# EAGLE design untitled (EAGLE 7.4.0)
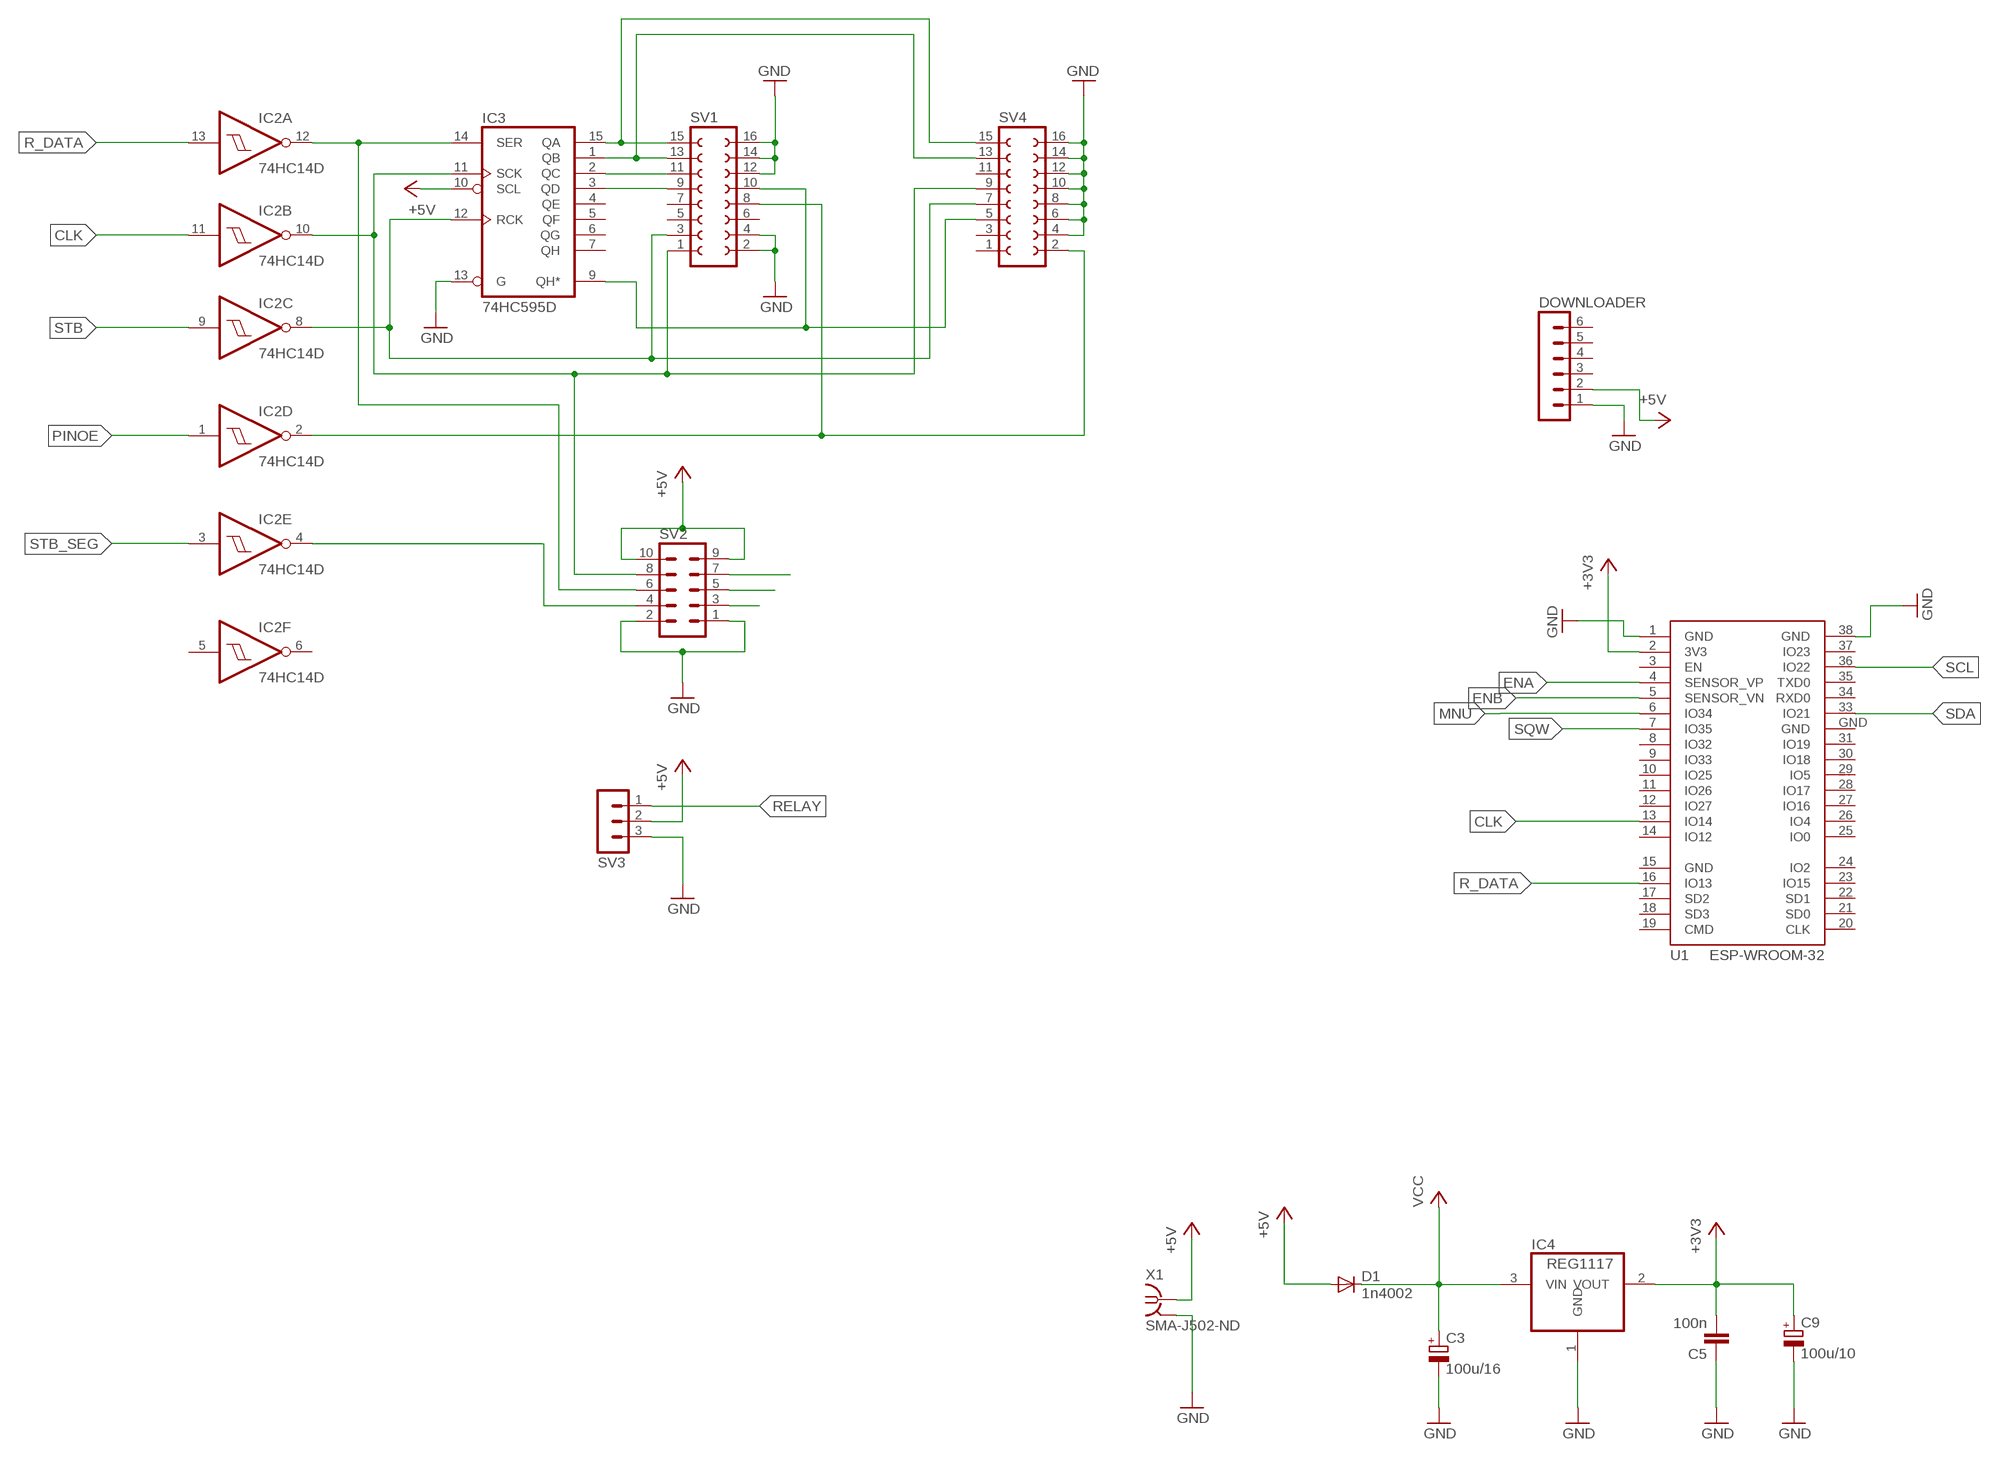
[diagram p0: schematic, sheet 1, part 1 of 2]
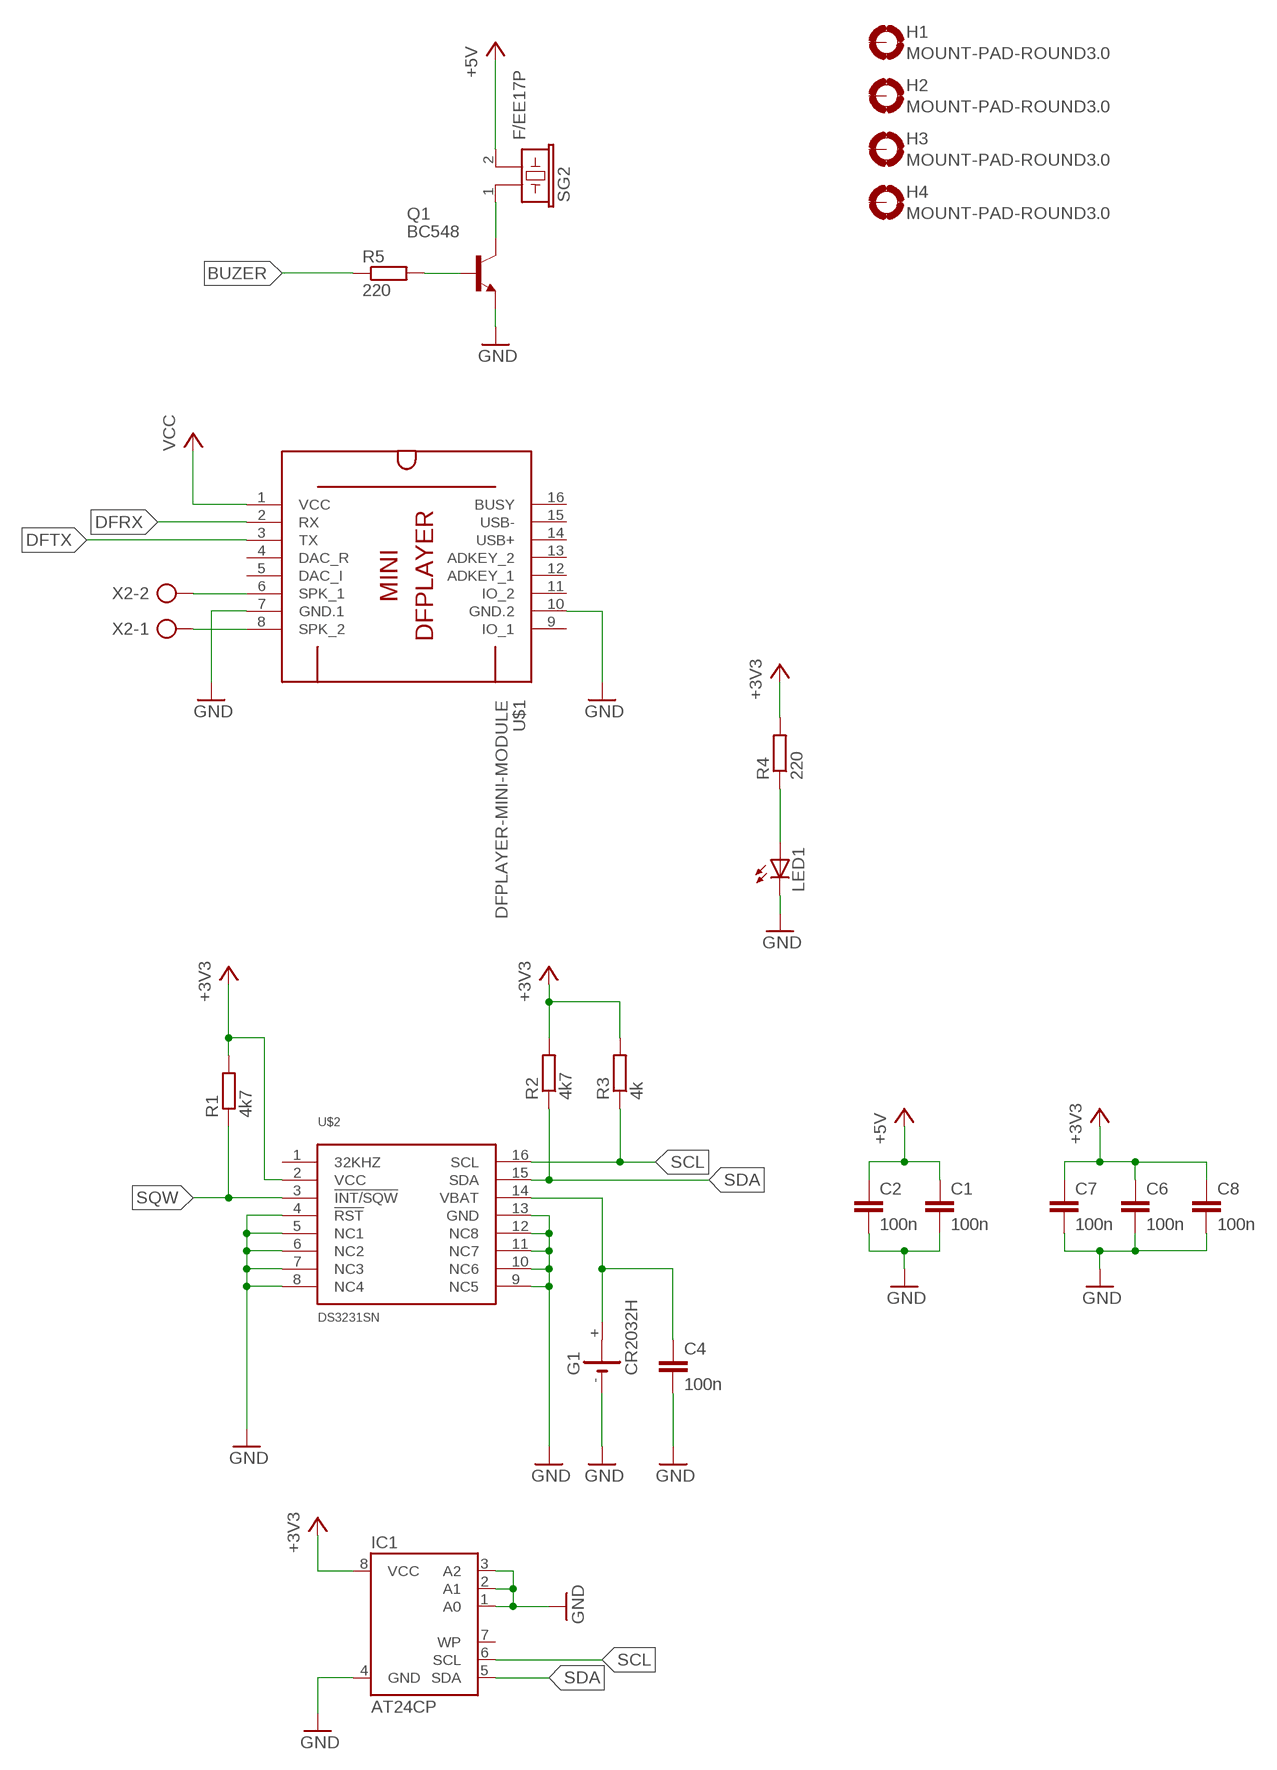
[diagram p1: schematic, sheet 1, part 2 of 2]

## Parts
C1  100n  C-EU025-025X050  [C025-025X050]
C2  100n  C-EU025-025X050  [C025-025X050]
C3  100u/16  CPOL-EUE2.5-6  [E2,5-6]
C4  100n  C-EU025-025X050  [C025-025X050]
C5  100n  C-EU025-025X050  [C025-025X050]
C6  100n  C-EU025-025X050  [C025-025X050]
C7  100n  C-EU025-025X050  [C025-025X050]
C8  100n  C-EU025-025X050  [C025-025X050]
C9  100u/10  CPOL-EUE2.5-5  [E2,5-5]
D1  1n4002  1N4148DO35-10  [DO35-10]
DOWNLOADER  MA06-1  [MA06-1]
G1  CR2032H  [CR2032H]
H1  MOUNT-PAD-ROUND3.0  [3,0-PAD]
H2  MOUNT-PAD-ROUND3.0  [3,0-PAD]
H3  MOUNT-PAD-ROUND3.0  [3,0-PAD]
H4  MOUNT-PAD-ROUND3.0  [3,0-PAD]
IC1  AT24CP  [DIL08]
IC2  74HC14D  [SO14]
IC3  74HC595D  [SO16]
IC4  REG1117  [SOT223]
LED1  LED3MM  [LED3MM]
Q1  BC548  [TO92-EBC]
R1  4k7  R-EU_0207/7  [0207/7]
R2  4k7  R-EU_0207/7  [0207/7]
R3  4k  R-EU_0207/7  [0207/7]
R4  220  R-EU_0207/7  [0207/7]
R5  220  R-EU_0207/7  [0207/7]
SG2  F/EE17P  [F/EE17P]
SV1  FE08-2  [FE08-2]
SV2  MA05-2  [MA05-2]
SV3  MA03-1  [MA03-1]
SV4  FE08-2  [FE08-2]
U1  ESP-WROOM-32  [ESP-WROOM-32]
U$1  DFPLAYER-MINI-MODULE  [DFPLAYER-MINI-MODULE]
U$2  DS3231SN  [SO16W]
X1  SMA-J502-ND  [J502-ND]
X2  AK500/2-H  [AK500/2-H]

## Nets
+3V3: C5.2 C6.1 C7.1 C8.1 C9.+ IC1.8(VCC) IC4.2(VOUT) R1.2 R2.2 R3.2 R4.2 U1.2(3V3) U$2.2(VCC)
+5V: C1.1 C2.1 D1.A DOWNLOADER.2 IC3.10(SCL) SG2.2 SV2.9 SV2.10 SV3.2 X1.3 X1.4
BUZER: R5.1
CLK: IC2.11(B:I) U1.13(IO14)
DFRX: U$1.2(RX)
DFTX: U$1.3(TX)
ENA: U1.4(SENSOR_VP)
ENB: U1.5(SENSOR_VN)
GND: C1.2 C2.2 C3.- C4.2 C5.1 C6.2 C7.2 C8.2 C9.- DOWNLOADER.1 G1.- IC1.1(A0) IC1.2(A1) IC1.3(A2) IC1.4(GND) IC3.13(G) IC4.1(GND) LED1.K(C) Q1.E SV1.2 SV1.4 SV1.12 SV1.14 SV1.16 SV2.1 SV2.2 SV3.3 SV4.4 SV4.6 SV4.8 SV4.10 SV4.12 SV4.14 SV4.16 U1.1(GND) U1.38(GND) U$1.7(GND.1) U$1.10(GND.2) U$2.4(!RST) U$2.5(NC1) U$2.6(NC2) U$2.7(NC3) U$2.8(NC4) U$2.9(NC5) U$2.10(NC6) U$2.11(NC7) U$2.12(NC8) U$2.13(GND) X1.2 X1.5
MNU: U1.6(IO34)
N$1: SV2.7
N$2: SV2.5
N$3: SV2.3
N$4: Q1.C SG2.1
N$5: C4.1 G1.+ U$2.14(VBAT)
N$6: Q1.B R5.2
N$7: LED1.A R4.1
N$8: U$1.6(SPK_1) X2.2
N$9: U$1.8(SPK_2) X2.1
N$11: IC2.12(A:O) IC3.14(SER) SV2.6
N$12: IC2.10(B:O) IC3.11(SCK) SV1.1 SV2.8 SV4.9
N$13: IC2.8(C:O) IC3.12(RCK) SV1.3 SV4.7
N$14: IC3.15(QA) SV1.15 SV4.15
N$15: IC3.1(QB) SV1.13 SV4.13
N$16: IC3.2(QC) SV1.11
N$17: IC3.3(QD) SV1.9
N$18: IC2.2(D:O) SV1.8 SV4.2
N$19: IC3.9(QH*) SV1.10 SV4.5
N$20: IC2.4(E:O) SV2.4
PINOE: IC2.1(D:I)
R_DATA: IC2.13(A:I) U1.16(IO13)
RELAY: SV3.1
SCL: IC1.6(SCL) R3.1 U1.36(IO22) U$2.16(SCL)
SDA: IC1.5(SDA) R2.1 U1.33(IO21) U$2.15(SDA)
SQW: R1.1 U1.7(IO35) U$2.3(!INT/SQW)
STB: IC2.9(C:I)
STB_SEG: IC2.3(E:I)
VCC: C3.+ D1.C IC4.3(VIN) U$1.1(VCC)
Unconnected: DOWNLOADER.3 DOWNLOADER.4 DOWNLOADER.5 DOWNLOADER.6 H1.B3,0(MOUNT) H2.B3,0(MOUNT) H3.B3,0(MOUNT) H4.B3,0(MOUNT) IC1.7(WP) IC2.5(F:I) IC2.6(F:O) IC3.4(QE) IC3.5(QF) IC3.6(QG) IC3.7(QH) SV1.5 SV1.6 SV1.7 SV4.1 SV4.3 SV4.11 U1.3(EN) U1.8(IO32) U1.9(IO33) U1.10(IO25) U1.11(IO26) U1.12(IO27) U1.14(IO12) U1.17(SD2) U1.18(SD3) U1.19(CMD) U1.20(CLK) U1.21(SD0) U1.22(SD1) U1.23(IO15) U1.24(IO2) U1.25(IO0) U1.26(IO4) U1.27(IO16) U1.28(IO17) U1.29(IO5) U1.30(IO18) U1.31(IO19) U1.34(RXD0) U1.35(TXD0) U1.37(IO23) U$1.4(DAC_R) U$1.5(DAC_I) U$1.9(IO_1) U$1.11(IO_2) U$1.12(ADKEY_1) U$1.13(ADKEY_2) U$1.14(USB+) U$1.15(USB-) U$1.16(BUSY) U$2.1(32KHZ)

## Power pins joined to a net without a drawn wire
GND: IC2.7(P:GND) IC3.8(GND) U1.15(GND) U1.GND
VCC: IC2.14(P:VCC) IC3.16(VCC)

## Library data of the parts
C1 C2 C4-C8 = pcb_control_esp:C-EU: CAPACITOR, European symbol
C3 C9 = rcl:CPOL-EU: POLARIZED CAPACITOR, European symbol
D1 = diode:1N4148: DIODE high speed (Philips)
DOWNLOADER = con-lstb:MA06-1: PIN HEADER; OC_FARNELL: unknown; OC_NEWARK: unknown
G1 = pcb_control_esp:CR2032H: LI BATTERY Varta
H1-H4 = holes:MOUNT-PAD-ROUND: MOUNTING PAD, round
IC1 = pcb_control_esp:AT24C*: 2-wire serial EEPROM; MPN: AT24C1024BW-SH-B; OC_FARNELL: 1362646; OC_NEWARK: 03P2044
IC2 = 74xx-eu:74*14: Hex schmitt trigger INVERTER
IC3 = 74xx-eu:74*595: 8-bit SHIFT REGISTER, output latch
IC4 = pcb_control_esp:REG1117: 800mA and 1A Low Dropout (LDO) Positive Regulator 1.8V, 2.5V, 2.85V, 3.3V, 5V, and Adj; MPN: REG1117; OC_FARNELL: 1097566; OC_NEWARK: 14P6981
LED1 = pcb_control_esp:LED: LED OSRAM: - CHIPLED LG R971, LG N971, LY N971, LG Q971, LY Q971, LO R971, LY R971 LH N974, LH R974 LS Q976, LO Q976, LY Q976 LO Q996 - Hyper CHIPLED LW Q18S LB Q993, LB Q99A, LB R99A - SideLED LS A670, LO A670, LY A670, LG A670, LP A670 LB A673, LV A673, LT A673, LW A673 LH A674 LY A675 LS A676, LA A676, LO A676, LY A676, LW A676 LS A679, LY A679, LG A679 - Hyper Micro SIDELED® LS Y876, LA Y876, LO Y876, LY Y876 LT Y87S - SmartLED LW L88C, LW L88S LB L89C, LB L89S, LG L890 LS L89K, LO L89K, LY L89K LS L896, LA L896, LO L896, LY L896 - TOPLED LS T670, LO T670, LY T670, LG T670, LP T670 LSG T670, LSP T670, LSY T670, LOP T670, LYG T670 LG T671, LOG T671, LSG T671 LB T673, LV T673, LT T673, LW T673 LH T674 LS T676, LA T676, LO T676, LY T676, LB T676, LH T676, LSB T676, LW T676 LB T67C, LV T67C, LT T67C, LS T67K, LO T67K, LY T67K, LW E67C LS E67B, LA E67B, LO E67B, LY E67B, LB E67C, LV E67C, LT E67C LW T67C LS T679, LY T679, LG T679 LS T770, LO T770, LY T770, LG T770, LP T770 LB T773, LV T773, LT T773, LW T773 LH T774 LS E675, LA E675, LY E675, LS T675 LS T776, LA T776, LO T776, LY T776, LB T776 LHGB T686 LT T68C, LB T68C - Hyper Mini TOPLED® LB M676 - Mini TOPLED Santana® LG M470 LS M47K, LO M47K, LY M47K Source: http://www.osram.convergy.de/
Q1 = pcb_control_esp:BC548*: NPN Transistor
R1-R5 = resistor:R-EU_: RESISTOR, European symbol
SG2 = buzzer:F/EE17P: BUZZER Source: Buerklin; OC_FARNELL: unknown; OC_NEWARK: unknown
SV1 SV4 = con-lsta:FE08-2: FEMALE HEADER; OC_FARNELL: unknown; OC_NEWARK: unknown
SV2 = con-lstb:MA05-2: PIN HEADER; OC_FARNELL: unknown; OC_NEWARK: unknown
SV3 = con-lstb:MA03-1: PIN HEADER; OC_FARNELL: unknown; OC_NEWARK: unknown
U1 = ESP32:ESP-WROOM-32: Espressif Systems ESP-WROOM-32
U$1 = pcb_control_esp:DFPLAYER-MINI-MODULE: DFPlayer Mini - MP3 player module based on YX5200 chip More details available here: https://www.dfrobot.com/wiki/index.php/DFPlayer_Mini_SKU:DFR0299 Click here to find device on ebay.com <http://www.ebay.com/sch/dfplayer+mini>
U$2 = pcb_control_esp:DS3231SN
X1 = pcb_control_esp:SMA-: SMA 50 Ohm End Launch Jack Receptacle - Round Contact Johnson Components Source: www.johnsoncomponents.com .. J502-ND.pdf; OC_FARNELL: unknown; OC_NEWARK: unknown
X2 = con-ptr500:AK500/2-H: CONNECTOR Aug. 2004 / PTR Meßtechnik: Die Bezeichnung der Serie AK505 wurde geändert. Es handelt sich hierbei um AK500 in horizontaler Ausführung.; OC_FARNELL: unknown; OC_NEWARK: unknown

## Board
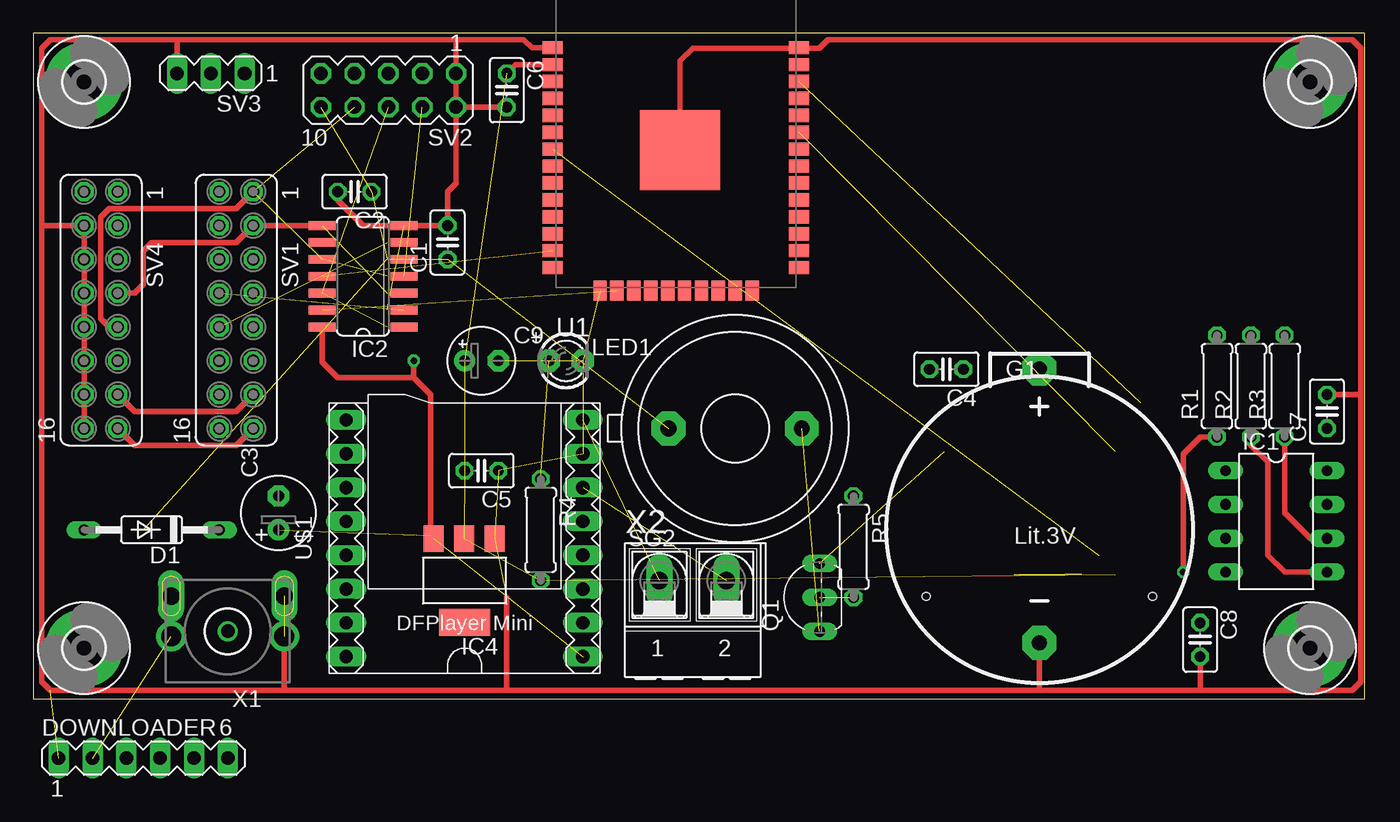
[diagram p2: board, top side]
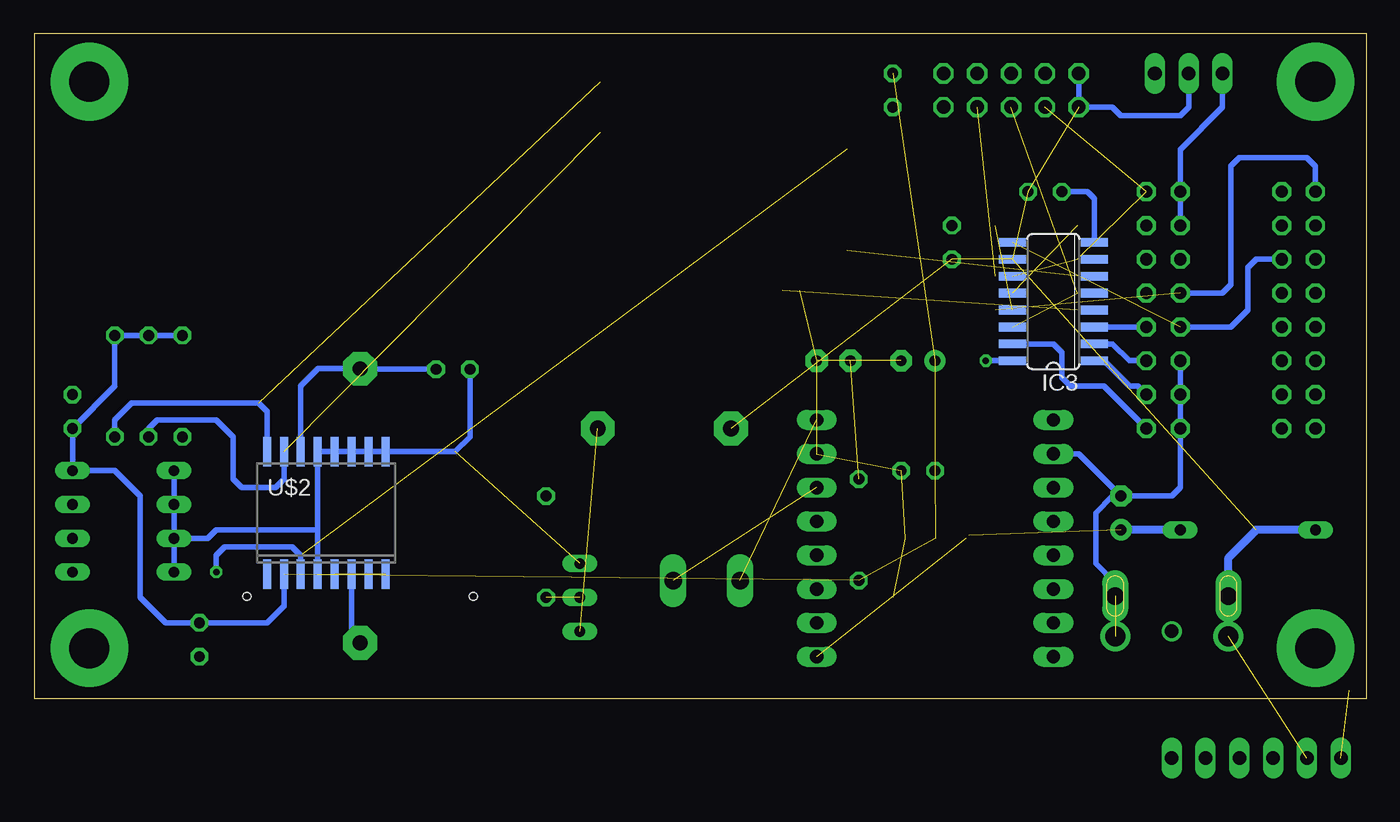
[diagram p3: board, bottom side, seen from below]

Size 100 x 50 mm. Coordinates in mm from the lower left corner, seen from the top.
Outline: 0,0 100,0 100,50 0,50 0,0
Copper layers (1*16): Top 0.035mm / dielectric 1.5mm / Bottom 0.035mm
Design rules "default": minimum track width 10mil, minimum drill 24mil, track to track 8mil, track to pad 8mil, pad to pad 8mil, via to via 8mil, smd to smd 8mil, copper to edge 40mil, drill to drill 8mil, minimum pad ring 10mil, minimum via ring 8mil, stop-mask expansion 4mil, vias tented up to drill 0mil, thermal gap 10mil

### Footprints (pad centres in the part's own frame; a part is rotated, then mirrored left to right if it is on the bottom)
C025-025X050 = drill 0.813 octagon: 1 -1.27,0; 2 1.27,0
E2,5-6 = drill 0.813 pad 1.6: + -1.27,0 | drill 0.813 pad 1.6 octagon: - 1.27,0
E2,5-5 = drill 0.813 pad 1.6: + -1.27,0 | drill 0.813 pad 1.6 octagon: - 1.27,0
DO35-10 = drill 0.813 long: A 5.08,0; C -5.08,0
MA06-1 = drill 1.016 long: 1 -6.35,0; 2 -3.81,0; 3 -1.27,0; 4 1.27,0; 5 3.81,0; 6 6.35,0
CR2032H = drill 1.118 pad 2.54 octagon: + 0,12.1; - 0,-8.5 | hole 0.6: -8.5,-5; 8.5,-5
3,0-PAD = drill 3 pad 5.842: B3,0 0,0
DIL08 = drill 0.813 long: 1 -3.81,-3.81; 2 -1.27,-3.81; 3 1.27,-3.81; 4 3.81,-3.81; 5 3.81,3.81; 6 1.27,3.81; 7 -1.27,3.81; 8 -3.81,3.81
SO14 = smd 0.66 x 2.032: 1 -3.81,-3.073; 2 -2.54,-3.073; 3 -1.27,-3.073; 4 0,-3.073; 5 1.27,-3.073; 6 2.54,-3.073; 7 3.81,-3.073; 8 3.81,3.073; 9 2.54,3.073; 10 1.27,3.073; 11 0,3.073; 12 -1.27,3.073; 13 -2.54,3.073; 14 -3.81,3.073
SO16 = smd 0.66 x 2.032: 1 -4.445,-3.073; 2 -3.175,-3.073; 3 -1.905,-3.073; 4 -0.635,-3.073; 5 0.635,-3.073; 6 1.905,-3.073; 7 3.175,-3.073; 8 4.445,-3.073; 9 4.445,3.073; 10 3.175,3.073; 11 1.905,3.073; 12 0.635,3.073; 13 -0.635,3.073; 14 -1.905,3.073; 15 -3.175,3.073; 16 -4.445,3.073
SOT223 = smd 1.499 x 2.007: 1 -2.261,-3.15; 2 0.025,-3.15; 3 2.311,-3.15 | smd 3.81 x 2.007: 4 0,3.15
LED3MM = drill 0.813 pad 1.676 octagon: A -1.27,0; K 1.27,0
TO92-EBC = drill 0.813 long: B 0,-1.27; C -2.54,-1.27; E 2.54,-1.27
0207/7 = drill 0.813 octagon: 1 -3.81,0; 2 3.81,0
F/EE17P = drill 1.194 pad 2.54 octagon: 1 -5.004,0; 2 5.004,0
FE08-2 = drill 0.914 octagon: 1 -8.89,1.27; 2 -8.89,-1.27; 3 -6.35,1.27; 4 -6.35,-1.27; 5 -3.81,1.27; 6 -3.81,-1.27; 7 -1.27,1.27; 8 -1.27,-1.27; 9 1.27,1.27; 10 1.27,-1.27; 11 3.81,1.27; 12 3.81,-1.27; 13 6.35,1.27; 14 6.35,-1.27; 15 8.89,1.27; 16 8.89,-1.27
MA05-2 = drill 1.016 octagon: 1 -5.08,-1.27; 2 -5.08,1.27; 3 -2.54,-1.27; 4 -2.54,1.27; 5 0,-1.27; 6 0,1.27; 7 2.54,-1.27; 8 2.54,1.27; 9 5.08,-1.27; 10 5.08,1.27
MA03-1 = drill 1.016 long: 1 -2.54,0; 2 0,0; 3 2.54,0
ESP-WROOM-32 = smd 1.5 x 1: 1 -9.25,7; 2 -9.25,5.73; 3 -9.25,4.46; 4 -9.25,3.19; 5 -9.25,1.92; 6 -9.25,0.65; 7 -9.25,-0.62; 8 -9.25,-1.89; 9 -9.25,-3.16; 10 -9.25,-4.43; 11 -9.25,-5.7; 12 -9.25,-6.97; 13 -9.25,-8.24; 14 -9.25,-9.51; 25 9.25,-9.51; 26 9.25,-8.24; 27 9.25,-6.97; 28 9.25,-5.7; 29 9.25,-4.43; 30 9.25,-3.16; 31 9.25,-1.89; 32 9.25,-0.62; 33 9.25,0.65; 34 9.25,1.92; 35 9.25,3.19; 36 9.25,4.46; 37 9.25,5.73; 38 9.25,7 | smd 1 x 1.5: 15 -5.7,-11.25; 16 -4.43,-11.25; 17 -3.16,-11.25; 18 -1.89,-11.25; 19 -0.62,-11.25; 20 0.65,-11.25; 21 1.92,-11.25; 22 3.19,-11.25; 23 4.46,-11.25; 24 5.73,-11.25 | smd 6 x 6: GND 0.3,-0.7
DFPLAYER-MINI-MODULE = drill 1 long: 1 -8.89,-8.89; 2 -6.35,-8.89; 3 -3.81,-8.89; 4 -1.27,-8.89; 5 1.27,-8.89; 6 3.81,-8.89; 7 6.35,-8.89; 8 8.89,-8.89; 9 8.89,8.89; 10 6.35,8.89; 11 3.81,8.89; 12 1.27,8.89; 13 -1.27,8.89; 14 -3.81,8.89; 15 -6.35,8.89; 16 -8.89,8.89
SO16W = smd 0.6 x 2.2: 1 -4.445,-4.6; 2 -3.175,-4.6; 3 -1.905,-4.6; 4 -0.635,-4.6; 5 0.635,-4.6; 6 1.905,-4.6; 7 3.175,-4.6; 8 4.445,-4.6; 9 4.445,4.6; 10 3.175,4.6; 11 1.905,4.6; 12 0.635,4.6; 13 -0.635,4.6; 14 -1.905,4.6; 15 -3.175,4.6; 16 -4.445,4.6
J502-ND = drill 1: 1 0,0 | drill 1.5: 2 -4.25,0.4; 3 4.25,0.4 | drill 1.3 long: 4 4.25,-2.65; 5 -4.25,-2.65
AK500/2-H = drill 1.321 long: 1 -2.515,0; 2 2.515,0

### Placement (x,y rotation side)
C1  31.11,34.29 90 top
C2  24.13,38.1 180 top
C3  18.41,13.97 90 top
C4  68.58,24.77 180 top
C5  33.66,17.14 180 top
C6  35.56,45.72 270 top
C7  97.16,21.59 90 top
C8  87.63,4.45 270 top
C9  33.66,25.4 0 top
D1  8.89,12.7 180 top
DOWNLOADER  8.26,-4.45 0 top  (outside the outline)
G1  75.56,12.7 0 top
H1  3.81,3.81 0 top
H2  95.89,3.81 0 top
H3  3.81,46.35 0 top
H4  95.89,46.35 0 top
IC1  93.34,13.34 270 top
IC2  24.77,31.75 90 top
IC3  23.5,29.84 90 bottom
IC4  32.38,8.89 180 top
LED1  40.01,25.4 0 top
Q1  57.78,7.62 90 top
R1  88.9,23.5 90 top
R2  91.44,23.5 90 top
R3  93.98,23.5 90 top
R4  38.1,12.7 270 top
R5  61.59,11.43 270 top
SG2  52.7,20.32 180 top
SV1  15.24,29.21 270 top
SV2  26.67,45.72 180 top
SV3  13.34,46.99 180 top
SV4  5.08,29.21 270 top
U1  48.26,41.91 0 top
U$1  32.38,12.06 90 top
U$2  78.11,13.97 0 bottom
X1  14.61,5.08 180 top
X2  49.53,8.89 0 top

### Tracks (layer width: path | path; a pad name or v marks a point on that pad's centre or on a via)
+3V3  (5 unrouted)
  Top 0.406: U1.2 36.21,47.64 C6.1
  Bottom 0.406: U$2.2 81.28,6.99 82.55,5.71 C8.1 90.17,5.71 92.08,7.62 92.08,15.24 93.98,17.14 IC1.8 C7.1 93.98,23.5 R3.2 R2.2 R1.2
+5V  (6 unrouted)
  Bottom 0.406: SV2.9 SV2.10 19.05,44.45 18.41,43.81 13.97,43.81 13.34,44.45 SV3.2
  Bottom 0.61: X1.3 X1.4 10.36,10.6 8.26,12.7 D1.A
CLK  (1 unrouted)
GND  (14 unrouted)
  Top 0.406: U1.1 37.45,48.91 36.83,49.53 31.75,49.53 | 31.75,49.53 10.79,49.53 | 10.79,49.53 1.27,49.53 0.64,48.9 0.64,35.56 | 0.64,35.56 0.64,1.27 1.27,0.64 19.05,0.64 | 19.05,0.64 35.56,0.64 | 35.56,0.64 75.56,0.64 | 75.56,0.64 87.63,0.64 | 87.63,0.64 99.06,0.64 99.69,1.27 99.69,22.86 | 99.69,22.86 99.69,48.9 99.06,49.53 59.69,49.53 59.05,48.9 57.52,48.9 U1.38 57.49,48.9 49.53,48.9 48.56,47.92 U1.GND | 35.56,7.62 35.56,0.64 | SV3.3 10.79,49.53 | G1.- 75.56,0.64 | C7.2 99.69,22.86 | C8.2 87.63,0.64 | X1.2 18.86,0.83 19.05,0.64 | C6.2 SV2.2 | 31.75,49.53 SV2.1 SV2.2 | SV2.2 31.75,38.73 31.11,38.1 C1.2 IC2.7 24.77,35.56 22.86,37.47 C2.2 | 0.64,35.56 SV4.4 SV4.6 SV4.8 SV4.10 SV4.12 SV4.14 SV4.16
  Bottom 0.406: U$2.6 76.2,4.83 G1.- | IC1.1 IC1.2 IC1.3 | IC1.3 87,12.06 86.36,12.7 78.74,12.7 | 78.74,12.7 U$2.4 | 78.74,12.7 U$2.13 U$2.12 U$2.11 U$2.10 U$2.9 68.42,18.57 67.31,19.68 C4.2 | IC1.3 IC1.4 | X1.5 18.86,8.7 20.32,10.16 20.32,13.97 19.05,15.24 C3.- | SV1.12 SV1.14 SV1.16 13.97,15.88 14.61,15.24 C3.- | U$1.10 21.59,18.41 C3.- | IC3.8 20.42,37.57 20.95,38.1 C2.2 | SV1.4 SV1.2 13.97,41.27 10.79,44.45 SV3.3
N$4  (1 unrouted)
N$5
  Bottom 0.406: U$2.14 80.01,23.5 78.7,24.8 G1.+ 75.53,24.77 C4.1
N$6  (1 unrouted)
N$7  (1 unrouted)
N$8  (1 unrouted)
N$9  (1 unrouted)
N$11  (2 unrouted)
N$12  (3 unrouted)
  Top 0.406: SV1.1 15.24,36.83 5.71,36.83 5.08,36.2 5.08,28.57 5.71,27.94 SV4.9
N$13  (1 unrouted)
  Top 0.406: IC2.8 SV1.3 15.24,34.29 8.89,34.29 8.26,33.66 8.26,31.11 7.62,30.48 SV4.7
N$14
  Top 0.406: SV1.15 15.24,19.05 7.62,19.05 SV4.15
  Bottom 0.406: IC3.15 23.5,26.67 22.86,26.04 22.86,24.13 22.23,23.5 19.68,23.5 SV1.15
N$15
  Top 0.406: SV1.13 15.24,21.59 7.62,21.59 SV4.13
  Bottom 0.406: IC3.1 19.68,25.4 17.78,23.5 17.14,23.5 SV1.13
N$16
  Bottom 0.406: IC3.2 19.05,26.67 17.78,25.4 SV1.11
N$17
  Bottom 0.406: IC3.3 SV1.9
N$18  (1 unrouted)
  Bottom 0.406: SV4.2 3.81,40.01 4.45,40.64 9.53,40.64 10.16,40.01 10.16,31.11 10.79,30.48 SV1.8
N$19  (1 unrouted)
  Bottom 0.406: SV1.10 10.16,27.94 8.89,29.21 8.89,32.38 8.26,33.02 SV4.5
N$20  (1 unrouted)
R_DATA  (1 unrouted)
SCL  (1 unrouted)
  Top 0.406: IC1.6 95.89,12.06 93.98,13.97 R3.1
  Bottom 0.406: R3.1 93.98,20.95 92.71,22.23 83.19,22.23 82.55,21.59 U$2.16
SDA  (1 unrouted)
  Top 0.406: R2.1 91.44,19.05 92.71,17.78 92.71,10.79 93.98,9.53 IC1.5
  Bottom 0.406: R2.1 91.44,20.32 90.81,20.95 86.36,20.95 85.09,19.68 85.09,16.51 84.45,15.88 81.92,15.88 81.28,16.51 U$2.15
SQW  (via drill 0.5)  (1 unrouted)
  Top 0.406: R1.1 87.63,19.68 86.36,18.41 v86.36,9.53
  Bottom 0.406: v86.36,9.53 86.36,10.79 85.72,11.43 80.64,11.43 80.01,10.79 U$2.3
VCC  (via drill 0.5)  (2 unrouted)
  Top 0.406: IC2.14 21.69,25.3 22.86,24.13 28.57,24.13 | 28.57,24.13 29.84,22.86 29.84,12.27 IC4.3 | v28.57,25.4 28.57,24.13
  Bottom 0.406: IC3.16 v28.57,25.4
  Bottom 0.61: D1.C C3.+